# EAGLE design breadboarder_supermini (EAGLE 6.5.0)
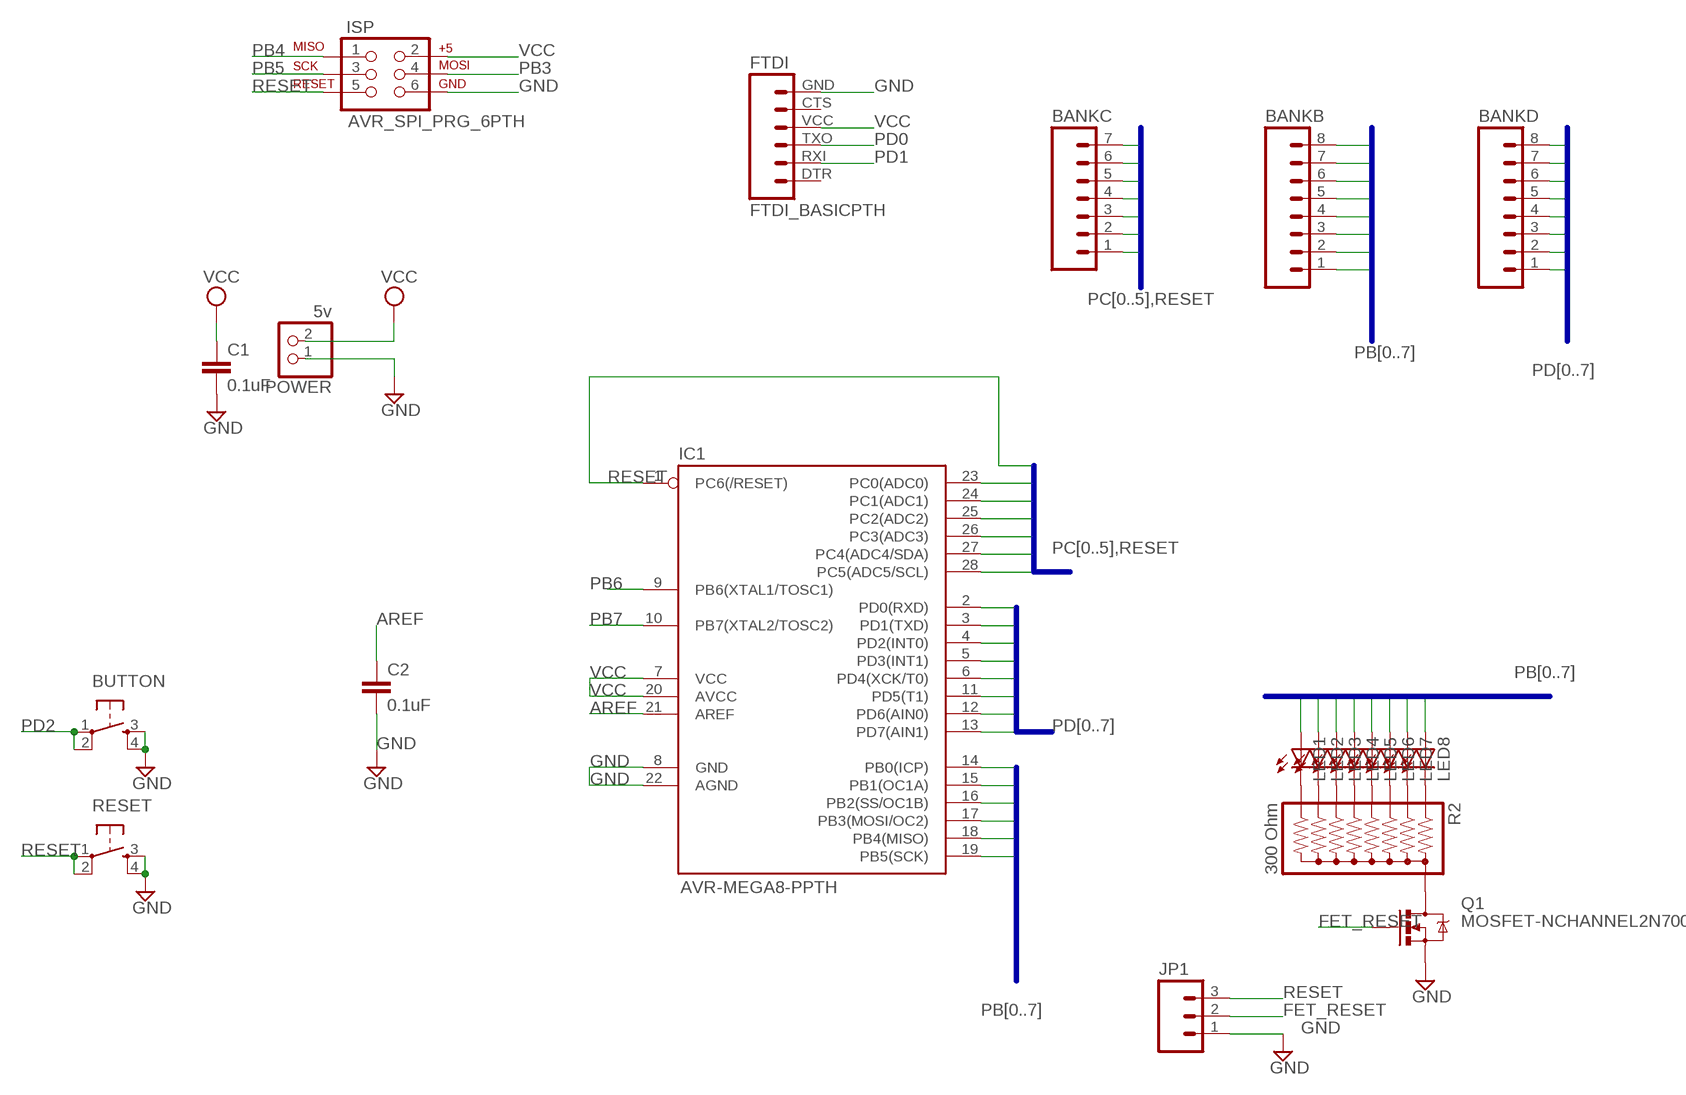
[diagram p0: schematic, sheet 1]

## Parts
BANKB  M08LONGPADS  [1X08_LONGPADS]
BANKC  M07LONGPADS  [1X07_LONGPADS]
BANKD  M08LONGPADS  [1X08_LONGPADS]
BUTTON  TAC_SWITCHPTH  [TACTILE-PTH]
C1  0.1uF  CAPKIT  [CAP-PTH-SMALL-KIT]
C2  0.1uF  CAPKIT  [CAP-PTH-SMALL-KIT]
FTDI  FTDI_BASICPTH  [FTDI_BASIC]
IC1  AVR-MEGA8-PPTH  [DIL28-3]
ISP  AVR_SPI_PRG_6PTH  [2X3]
JP1  M03PTH  [1X03]
LED1  LED3MM  [LED3MM]
LED2  LED3MM  [LED3MM]
LED3  LED3MM  [LED3MM]
LED4  LED3MM  [LED3MM]
LED5  LED3MM  [LED3MM]
LED6  LED3MM  [LED3MM]
LED7  LED3MM  [LED3MM]
LED8  LED3MM  [LED3MM]
POWER  5v  PINHD-1X2  [1X02]
Q1  MOSFET-NCHANNEL2N7000  [TO-92]
R2  300 Ohm  RPACK-BUSSED-8SIP-PTH-8-LP  [RPACK-SIP-PTH-8-LP]
RESET  TAC_SWITCHPTH  [TACTILE-PTH]

## Nets
AREF: C2.1 IC1.21(AREF)
FET_RESET: JP1.2 Q1.2(G)
GND: BUTTON.3 BUTTON.4 C1.2 C2.2 FTDI.GND IC1.8(GND) IC1.22(AGND) ISP.6 JP1.1 POWER.1 Q1.1(S) RESET.3 RESET.4
N$1: Q1.3(D) R2.P$1
N$2: LED1.K(C) R2.P$9
N$3: LED2.K(C) R2.P$8
N$4: LED3.K(C) R2.P$7
N$5: LED4.K(C) R2.P$6
N$6: LED5.K(C) R2.P$5
N$7: LED6.K(C) R2.P$4
N$8: LED7.K(C) R2.P$3
N$9: LED8.K(C) R2.P$2
PB0: BANKB.8 IC1.14(PB0(ICP)) LED1.A
PB1: BANKB.7 IC1.15(PB1(OC1A)) LED2.A
PB2: BANKB.6 IC1.16(PB2(SS/OC1B)) LED3.A
PB3: BANKB.5 IC1.17(PB3(MOSI/OC2)) ISP.4 LED4.A
PB4: BANKB.4 IC1.18(PB4(MISO)) ISP.1 LED5.A
PB5: BANKB.3 IC1.19(PB5(SCK)) ISP.3 LED6.A
PB6: BANKB.2 IC1.9(PB6(XTAL1/TOSC1)) LED7.A
PB7: BANKB.1 IC1.10(PB7(XTAL2/TOSC2)) LED8.A
PC0: BANKC.7 IC1.23(PC0(ADC0))
PC1: BANKC.6 IC1.24(PC1(ADC1))
PC2: BANKC.5 IC1.25(PC2(ADC2))
PC3: BANKC.4 IC1.26(PC3(ADC3))
PC4: BANKC.3 IC1.27(PC4(ADC4/SDA))
PC5: BANKC.2 IC1.28(PC5(ADC5/SCL))
PD0: BANKD.8 FTDI.TXO IC1.2(PD0(RXD))
PD1: BANKD.7 FTDI.RXI IC1.3(PD1(TXD))
PD2: BANKD.6 BUTTON.1 BUTTON.2 IC1.4(PD2(INT0))
PD3: BANKD.5 IC1.5(PD3(INT1))
PD4: BANKD.4 IC1.6(PD4(XCK/T0))
PD5: BANKD.3 IC1.11(PD5(T1))
PD6: BANKD.2 IC1.12(PD6(AIN0))
PD7: BANKD.1 IC1.13(PD7(AIN1))
RESET: BANKC.1 IC1.1(PC6(/RESET)) ISP.5 JP1.3 RESET.1 RESET.2
VCC: C1.1 FTDI.VCC IC1.7(VCC) IC1.20(AVCC) ISP.2 POWER.2
Unconnected: FTDI.CTS FTDI.DTR

## Buses
PC[0..5],RESET
PB[0..7]
PD[0..7]

## Library data of the parts
BANKB BANKD = SparkFun-Connectors:M08: Header 8 Standard 8-pin 0.1" header. Use with straight break away headers (SKU : PRT-00116), right angle break away headers (PRT-00553), swiss pins (PRT-00743), machine pins (PRT-00117), and female headers (PRT-00115).
BANKC = SparkFun-Connectors:M07: Header 7 Standard 7-pin 0.1" header. Use with straight break away headers (SKU : PRT-00116), right angle break away headers (PRT-00553), swiss pins (PRT-00743), machine pins (PRT-00117), and female headers (PRT-00115). NOTES ON THE VARIANTS LOCK and LOCK_LONGPADS... This footprint was designed to help hold the alignment of a through-hole component (i.e. 7-pin header) while soldering it into place. You may notice that each hole has been shifted either up or down by 0.005 of an inch from it's more standard position (which is usually a perfectly straight line). This slight alteration caused the pins (the squares in the middle) to touch the edges of the holes. Because they are alternating, it causes a "brace" to hold the header in place. 0.005 has proven to be the perfect amount of "off-center" position when using our standard breakaway headers. Although looks a little odd when you look at the bare footprint, once you have a header in there, the alteration is very hard to notice. Also, if you push a header all the way into place, it is covered up entirely on the bottom side. This idea of altering the position of holes to aid alignment will be further integrated into the Sparkfun Library for other footprints. It can help hold any component with 3 or more connection pins.
BUTTON RESET = SparkFun-Electromechanical:TAC_SWITCH: Momentary Switch Button commonly used for reset or general input. Spark Fun Electronics SKU : COM-00097 SMT- SWCH-08247
C1 C2 = SparkFun-Capacitors:CAP: Capacitor Standard 0603 ceramic capacitor, and 0.1" leaded capacitor.
FTDI = SparkFun-Connectors:FTDI_BASIC: FTDI Basic header with labels
IC1 = SparkFun-DigitalIC:AVR-MEGA8-P: MICROCONTROLLER 8 Kbytes FLASH 1 kbytes SRAM 512 bytes EEPROM USART 4-channel 10 bit ADC 2-channel 8 bit ADC
ISP = SparkFun-Connectors:AVR_SPI_PRG_6: AVR ISP 6 Pin This is the reduced ISP connector for AVR programming. Common on Arduino. This footprint will take up less PCB space and can be used with a 10-pin to 6-pin adapter such as SKU: BOB-08508
JP1 = SparkFun-Connectors:M03: Header 3 Standard 3-pin 0.1" header. Use with straight break away headers (SKU : PRT-00116), right angle break away headers (PRT-00553), swiss pins (PRT-00743), machine pins (PRT-00117), and female headers (PRT-00115). Molex polarized connector foot print use with SKU : PRT-08232 with associated crimp pins and housings.
LED1-LED8 = SparkFun-LED:LED: LEDs Standard schematic elements and footprints for 5mm, 3mm, 1206, and 0603 sized LEDs. 5mm - Spark Fun Electronics SKU : COM-00529 (and others)
POWER = pinhead:PINHD-1X2: PIN HEADER
Q1 = SparkFun-DiscreteSemi:MOSFET-NCHANNEL: Common NMOSFET Parts MFG P/N Store ID Prod ID FDD8780 TRANS-09984 SI7820DN TRANS-11055 FDS6630A IC-08089 2N7002PW TRANS-11151 FQP30N06L COM-10213 TRANS-10060 BSS123LT1G TRANS-08345 BSS138 TRANS-00830 BS170 2N7000
R2 = SparkFun-Resistors:RPACK-BUSSED-8: BOURNS 4600X/R series thick-film SIP resistor packs Height resistors bussed to a single pin (denoted by dot). datasheet <http://dlnmh9ip6v2uc.cloudfront.net/datasheets/Components/General/4600x.pdf> SIMILAR TO: SFE parts COM-10855 (330), COM-10856 (10K)

## Board
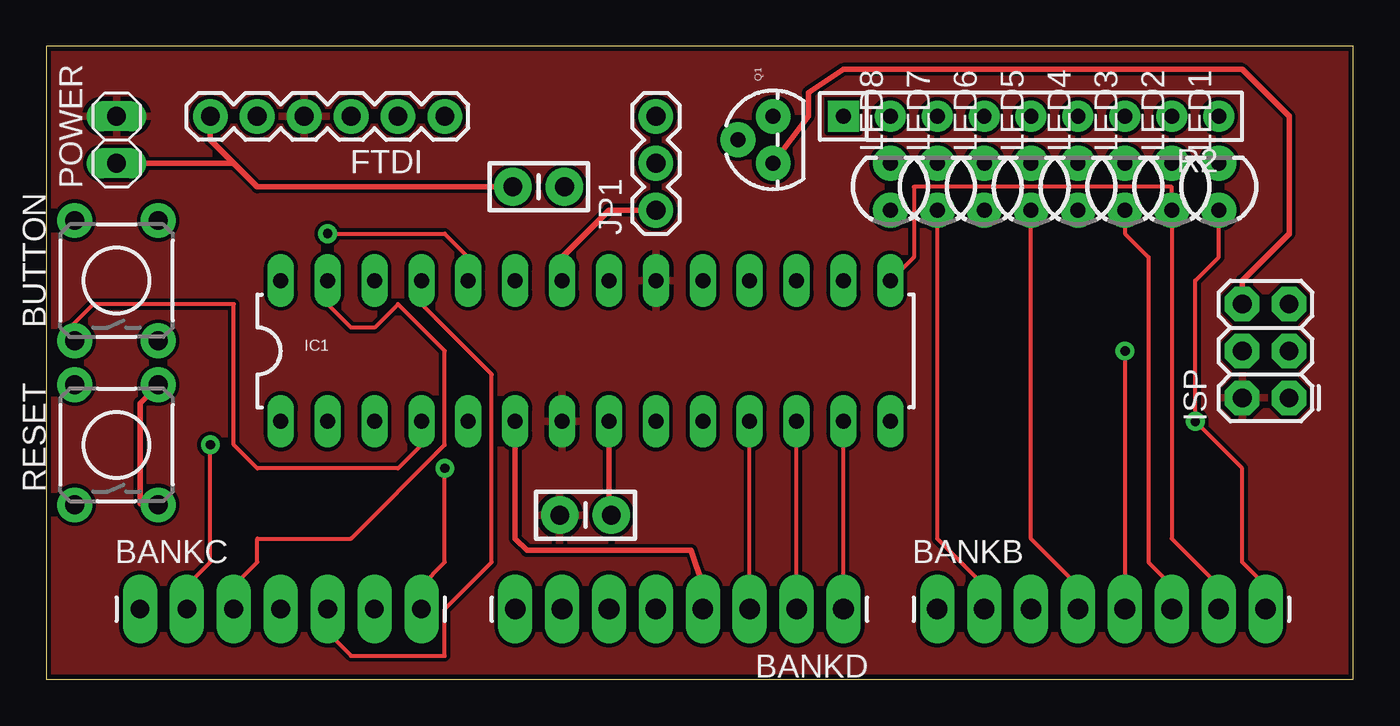
[diagram p1: board, top side]
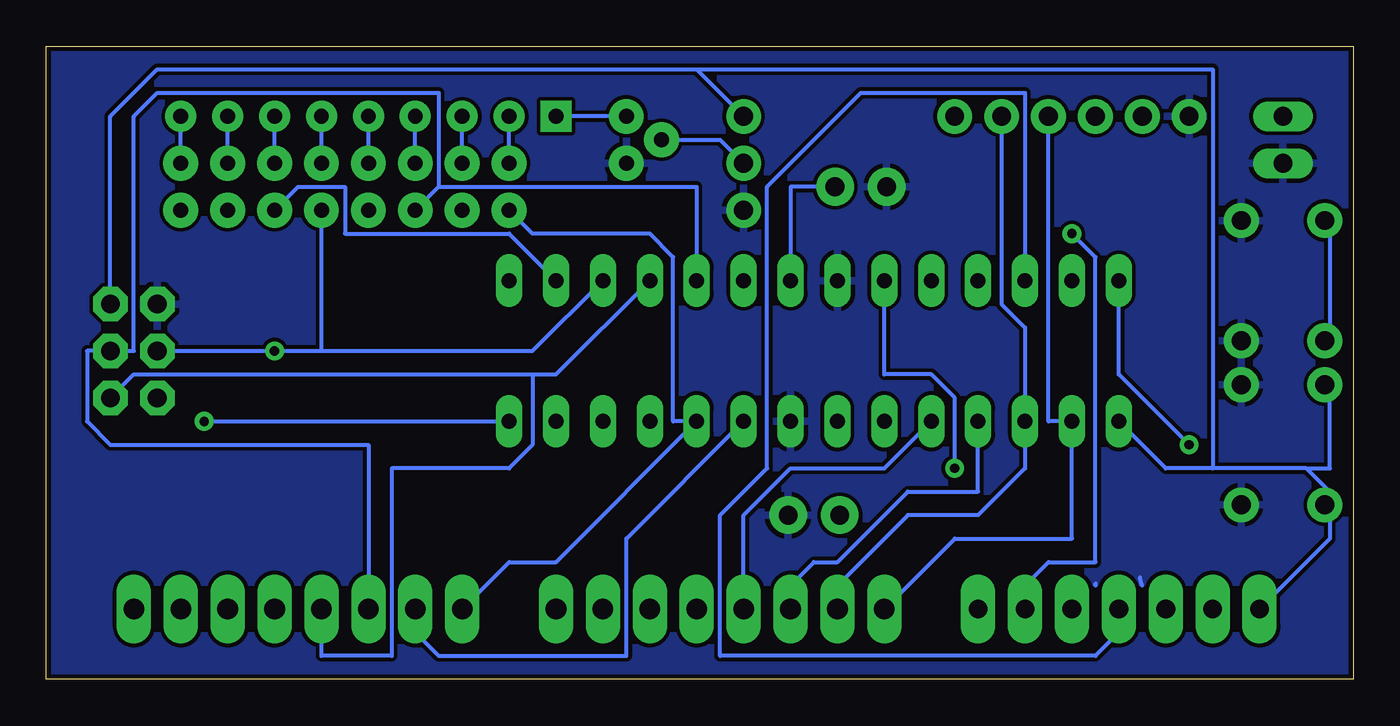
[diagram p2: board, bottom side, seen from below]

Size 70.79 x 34.28 mm. Coordinates in mm from the lower left corner, seen from the top.
Outline: 0,0 70.79,0 70.79,34.28 0,34.28 0,0
Copper layers (1*16): Top 0.035mm / dielectric 1.5mm / Bottom 0.035mm
Design rules "SparkFun": minimum track width 8mil, minimum drill 20mil, track to track 8mil, track to pad 8mil, pad to pad 8mil, via to via 8mil, smd to smd 8mil, copper to edge 10mil, drill to drill 8mil, minimum pad ring 12mil, minimum via ring 10mil, stop-mask expansion 4mil, vias tented up to drill 25mil, thermal gap 10mil

### Footprints (pad centres in the part's own frame; a part is rotated, then mirrored left to right if it is on the bottom)
1X08_LONGPADS = drill 1.118 pad 1.88 long: 1 0,0; 2 2.54,0; 3 5.08,0; 4 7.62,0; 5 10.16,0; 6 12.7,0; 7 15.24,0; 8 17.78,0
1X07_LONGPADS = drill 1.016 pad 1.88 long: 1 0,0; 2 2.54,0; 3 5.08,0; 4 7.62,0; 5 10.16,0; 6 12.7,0; 7 15.24,0
TACTILE-PTH = drill 1.016 pad 1.88: 1 -3.251,2.261; 2 3.251,2.261; 3 -3.251,-2.261; 4 3.251,-2.261
CAP-PTH-SMALL-KIT = drill 1.016 pad 2.032: 1 -1.397,0; 2 1.397,0
FTDI_BASIC = drill 1.016 pad 1.88: CTS 10.16,0; DTR 0,0; GND 12.7,0; RXI 2.54,0; TXO 5.08,0; VCC 7.62,0
DIL28-3 = drill 0.813 long: 1 -16.51,-3.81; 2 -13.97,-3.81; 3 -11.43,-3.81; 4 -8.89,-3.81; 5 -6.35,-3.81; 6 -3.81,-3.81; 7 -1.27,-3.81; 8 1.27,-3.81; 9 3.81,-3.81; 10 6.35,-3.81; 11 8.89,-3.81; 12 11.43,-3.81; 13 13.97,-3.81; 14 16.51,-3.81; 15 16.51,3.81; 16 13.97,3.81; 17 11.43,3.81; 18 8.89,3.81; 19 6.35,3.81; 20 3.81,3.81; 21 1.27,3.81; 22 -1.27,3.81; 23 -3.81,3.81; 24 -6.35,3.81; 25 -8.89,3.81; 26 -11.43,3.81; 27 -13.97,3.81; 28 -16.51,3.81
2X3 = drill 1.016 pad 1.88 octagon: 1 0,0; 2 0,2.54; 3 2.54,0; 4 2.54,2.54; 5 5.08,0; 6 5.08,2.54
1X03 = drill 1.016 pad 1.88: 1 0,0; 2 2.54,0; 3 5.08,0
LED3MM = drill 0.813 pad 1.88: A -1.27,0; K 1.27,0
1X02 = drill 1.016 long: 1 -1.27,0; 2 1.27,0
TO-92 = drill 0.813 pad 1.88: 1 -1.27,0; 2 0,1.905; 3 1.27,0
RPACK-SIP-PTH-8-LP = drill 0.8 pad 1.676 square: P$1 0,0 | drill 0.8 pad 1.676: P$2 0,-2.54; P$3 0,-5.08; P$4 0,-7.62; P$5 0,-10.16; P$6 0,-12.7; P$7 0,-15.24; P$8 0,-17.78; P$9 0,-20.32

### Placement (x,y rotation side)
BANKB  48.26,3.81 0 top
BANKC  5.08,3.81 0 top
BANKD  43.18,3.81 180 top
BUTTON  3.81,21.59 90 top
C1  29.21,8.89 0 top
C2  26.67,26.67 180 top
FTDI  21.59,30.48 180 top
IC1  29.21,17.78 0 top
ISP  67.31,15.24 90 top
JP1  33.02,25.4 90 top
LED1  63.5,26.67 90 top
LED2  60.96,26.67 90 top
LED3  58.42,26.67 90 top
LED4  55.88,26.67 90 top
LED5  53.34,26.67 90 top
LED6  50.8,26.67 90 top
LED7  48.26,26.67 90 top
LED8  45.72,26.67 90 top
POWER  3.81,29.21 90 top
Q1  39.37,29.21 90 top
R2  43.18,30.48 90 top
RESET  3.81,12.7 90 top

### Tracks (layer width: path | path; a pad name or v marks a point on that pad's centre or on a via)
AREF
  Bottom 0.203: IC1.21 30.48,26.67 C2.1 27.94,26.67
FET_RESET
  Bottom 0.203: JP1.2 34.29,29.21 Q1.2
GND
  Top 0.305: JP1.1 30.48,25.4 27.94,22.86 IC1.22 | C2.2 11.43,26.67 10.16,27.94 | 10.16,27.94 8.89,29.21 FTDI.GND | POWER.1 10.16,27.94 | ISP.6 64.77,21.59 67.31,24.13 67.31,30.48 64.77,33.02 43.18,33.02 41.27,31.75 41.27,30.48 Q1.1 | IC1.8 30.48,9.02 C1.2 | RESET.4 5.08,14.96 5.08,9.5 6.02,9.5 RESET.3
  Bottom 0.203: 13.97,5.08 13.97,5.2 | 11.43,5.08 11.56,5.51
  pour Bottom: -16.51,44.45 -17.78,44.45 -17.78,-1.27 73.66,-1.27 73.66,44.45
N$1
  Bottom 0.203: Q1.3 R2.P$1
N$2
  Bottom 0.203: LED1.K R2.P$9
N$3
  Bottom 0.203: LED2.K R2.P$8
N$4
  Bottom 0.203: LED3.K R2.P$7
N$5
  Bottom 0.203: LED4.K R2.P$6
N$6
  Bottom 0.203: LED5.K R2.P$5
N$7
  Bottom 0.203: LED6.K R2.P$4
N$8
  Bottom 0.203: LED7.K R2.P$3
N$9
  Bottom 0.203: LED8.K R2.P$2
PB0  (via drill 0.51)
  Top 0.203: BANKB.8 66.04,5.08 64.77,6.35 64.77,11.43 v62.23,13.97 62.23,21.59 63.5,22.86 LED1.A
  Bottom 0.203: v62.23,13.97 IC1.14
PB1
  Top 0.203: IC1.15 46.99,22.86 46.99,26.67 60.96,26.67 LED2.A 60.96,7.62 63.5,5.08 BANKB.7
PB2
  Top 0.203: BANKB.6 60.96,5.08 59.69,6.35 59.69,22.86 58.42,24.13 LED3.A
  Bottom 0.203: IC1.16 45.72,24.13 54.61,24.13 54.61,26.67 57.15,26.67 LED3.A
PB3  (via drill 0.51)
  Top 0.203: v58.42,17.78 BANKB.5
  Bottom 0.203: IC1.17 44.45,17.78 55.88,17.78 | ISP.4 v58.42,17.78 55.88,17.78 | 55.88,17.78 LED4.A
PB4
  Top 0.203: LED5.A 53.34,7.62 55.88,5.08 BANKB.4
  Bottom 0.203: IC1.18 43.18,16.51 44.45,16.51 | 44.45,16.51 66.04,16.51 ISP.1 | BANKB.4 55.88,1.27 52.07,1.27 52.07,11.43 45.72,11.43 44.45,12.7 44.45,16.51
PB5
  Bottom 0.203: IC1.19 35.56,26.67 49.53,26.67 | LED6.A 49.53,26.67 | BANKB.3 53.34,12.7 67.31,12.7 68.58,13.97 68.58,17.78 ISP.3 66.04,17.78 66.04,30.48 64.77,31.75 49.53,31.75 49.53,26.67
PB6
  Top 0.203: LED7.A 48.26,7.62 50.8,5.08 BANKB.2
  Bottom 0.203: IC1.9 39.37,7.62 39.37,1.27 49.53,1.27 50.8,2.54 BANKB.2
PB7
  Bottom 0.203: BANKB.1 45.72,6.35 43.18,6.35 IC1.10 36.83,13.97 36.83,22.86 38.1,24.13 44.45,24.13 LED8.A
PC0  (via drill 0.51)
  Top 0.203: v21.59,11.43 21.59,6.35 20.32,5.08 BANKC.7
  Bottom 0.203: IC1.23 25.4,16.51 22.86,16.51 21.59,15.24 v21.59,11.43
PC1  (via drill 0.51)
  Top 0.203: IC1.24 22.86,22.86 21.59,24.13 v15.24,24.13
  Bottom 0.203: v15.24,24.13 13.97,22.86 13.97,6.35 16.51,6.35 17.78,5.08 BANKC.6
PC2
  Top 0.203: IC1.25 20.32,20.32 24.13,16.51 24.13,6.35 21.59,3.81 21.59,1.27 16.51,1.27 15.24,2.54 BANKC.5
PC3
  Bottom 0.203: IC1.26 17.78,31.75 26.67,31.75 31.75,26.67 31.75,11.43 34.29,8.89 34.29,1.27 13.97,1.27 12.7,2.54 BANKC.4
PC4
  Top 0.203: IC1.27 15.24,20.32 16.51,19.05 17.78,19.05 19.05,20.32 21.59,17.78 21.59,12.7 16.51,7.62 11.43,7.62 11.43,6.35 10.16,5.08 BANKC.3
PC5  (via drill 0.51)
  Top 0.203: v8.89,12.7 8.89,6.35 7.62,5.08 BANKC.2
  Bottom 0.203: IC1.28 12.7,16.51 v8.89,12.7
PD0
  Bottom 0.203: BANKD.8 21.59,7.62 15.24,7.62 IC1.2 16.51,13.97 FTDI.TXO
PD1
  Bottom 0.203: FTDI.RXI 19.05,20.32 17.78,19.05 IC1.3 17.78,11.43 20.32,8.89 24.13,8.89 27.94,5.08 BANKD.7
PD2
  Top 0.203: IC1.4 20.32,12.7 19.05,11.43 11.43,11.43 10.16,12.7 10.16,20.32 2.54,20.32 1.27,19.05 BUTTON.1
  Bottom 0.203: BUTTON.1 1.27,19.05 1.27,24.13 BUTTON.2 | IC1.4 20.32,10.16 24.13,10.16 27.94,6.35 29.21,6.35 30.48,5.08 BANKD.6
PD3
  Bottom 0.203: IC1.5 25.4,11.43 30.48,11.43 33.02,8.89 BANKD.5
PD4
  Top 0.305: IC1.6 25.4,7.62 26.04,6.98 34.92,6.98 35.56,5.08 BANKD.4
PD5
  Top 0.203: BANKD.3 IC1.11
PD6
  Top 0.203: BANKD.2 IC1.12
PD7
  Top 0.203: BANKD.1 IC1.13
RESET
  Bottom 0.203: IC1.1 10.16,11.43 7.62,11.43 | 2.54,11.43 7.62,11.43 | 2.54,11.43 1.27,10.16 RESET.1 1.27,8.89 1.27,7.62 BANKC.1 | 2.54,11.43 1.27,11.43 1.27,15.24 RESET.2 | 35.56,33.02 JP1.3 | 35.56,33.02 64.77,33.02 67.31,30.48 ISP.5 | 7.62,11.43 7.62,33.02 35.56,33.02
VCC
  pour Top: -15.24,44.45 -15.24,0 69.85,0 71.12,0 71.12,44.45